# EAGLE design Breakout (EAGLE 6.5.0)
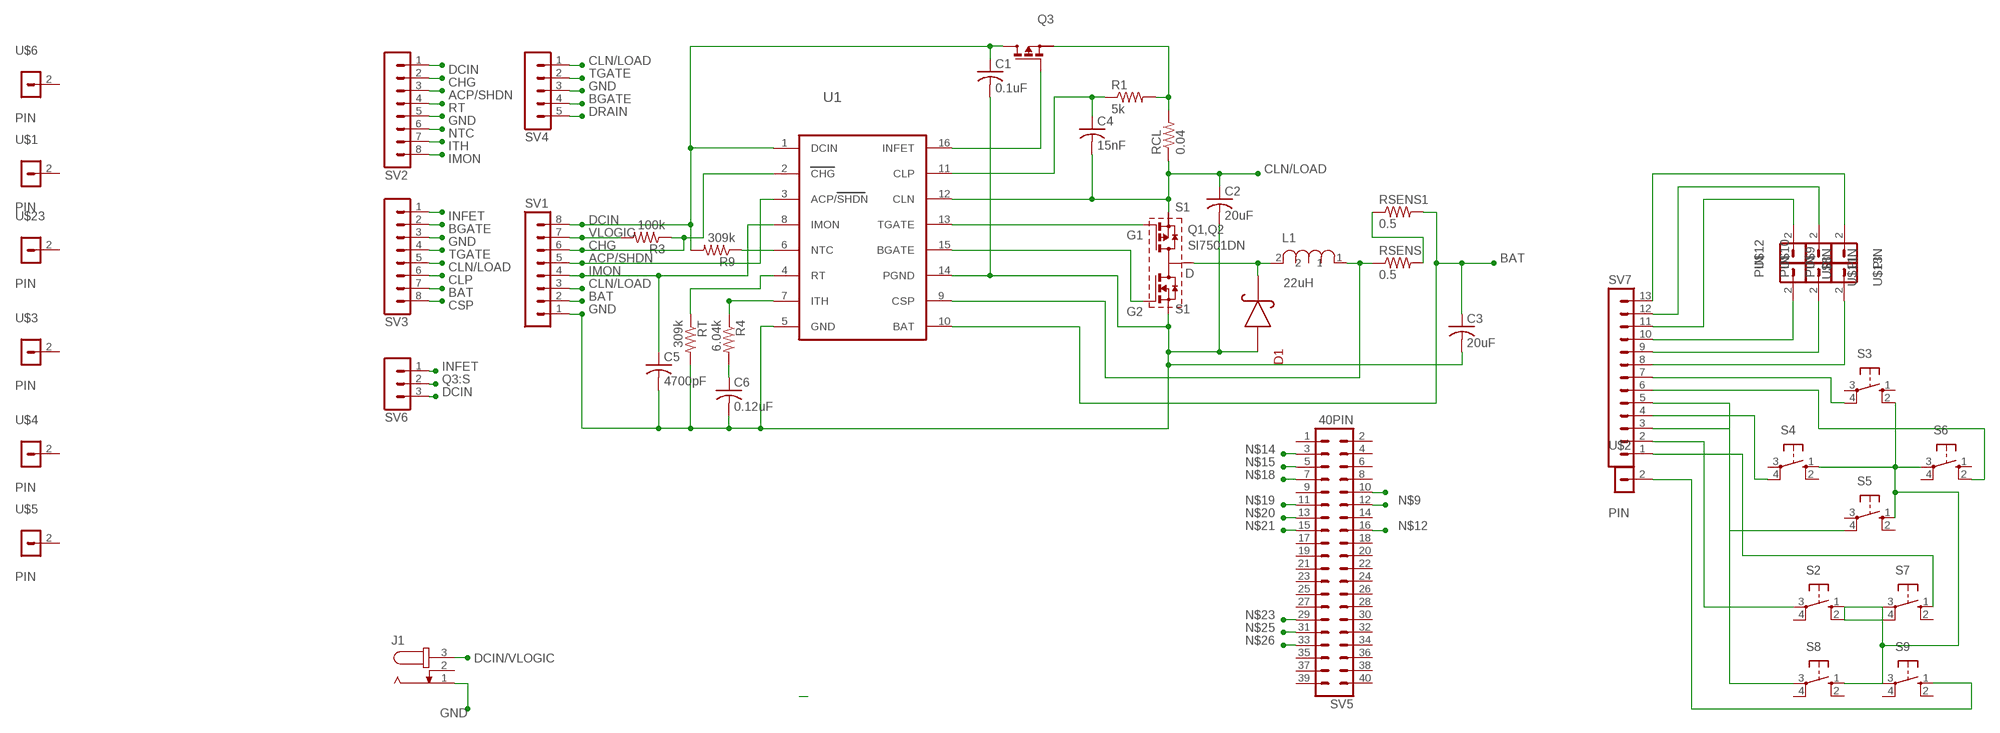
[diagram p0: schematic, sheet 1]

## Parts
C1  0.1uF  C-USC1210  [C1210]
C2  20uF  C-USC1210  [C1210]
C3  20uF  C-USC1210  [C1210]
C4  15nF  C-USC1210  [C1210]
C5  4700pF  C-USC1210  [C1210]
C6  0.12uF  C-USC1210  [C1210]
D1  DIODE  [DIODE]
J1  JACK-PLUG0  [SPC4077]
L1  22uH  SDR1005INDUCTOR  [POWERINDUCTOR]
Q1,Q2  SI7501DN  [POWERPAK]
Q3  MOSFET  [SOT-23]
R1  5k  R-US_R1206  [R1206]
R3  100k  R-US_R1206  [R1206]
R4  6.04k  R-US_R1206  [R1206]
R9  309k  R-US_R1206  [R1206]
RCL  0.04  R-US_R1206  [R1206]
RSENS  0.5  0612/1632  [0612/1632]
RSENS1  0.5  0612/1632  [0612/1632]
RT  309k  R-US_R1206  [R1206]
S2  10-XX  [B3F-10XX]
S3  10-XX  [B3F-10XX]
S4  10-XX  [B3F-10XX]
S5  10-XX  [B3F-10XX]
S6  10-XX  [B3F-10XX]
S7  10-XX  [B3F-10XX]
S8  10-XX  [B3F-10XX]
S9  10-XX  [B3F-10XX]
SV1  MA08-1  [MA08-1]
SV2  MA08-1  [MA08-1]
SV3  MA08-1  [MA08-1]
SV4  MA05-1  [MA05-1]
SV5  40PIN  [40PINHEADDER]
SV6  MA03-1  [MA03-1]
SV7  MA13-1  [MA13-1]
U1  LTC6004  [SSOP-16]
U$1  PIN  [PIN]
U$2  PIN  [PIN]
U$3  PIN  [PIN]
U$4  PIN  [PIN]
U$5  PIN  [PIN]
U$6  PIN  [PIN]
U$8  PIN  [PIN]
U$9  PIN  [PIN]
U$10  PIN  [PIN]
U$11  PIN  [PIN]
U$12  PIN  [PIN]
U$13  PIN  [PIN]
U$23  PIN  [PIN]

## Nets
ACP/SHDN: SV1.5 SV2.3 U1.3(ACP/SHDN)
BAT: C3.1 RSENS1.2 SV1.2 SV3.7 U1.10(BAT)
BGATE: Q1,Q2.G2 SV3.2 SV4.4 U1.15(BGATE)
CHG: R3.1 SV1.6 SV2.2 U1.2(CHG)
CLN/LOAD: C2.1 C4.2 Q1,Q2.S1 RCL.1 SV1.3 SV3.5 SV4.1 U1.12(CLN)
CLP: C4.1 R1.1 SV3.6 U1.11(CLP)
CSP: L1.1 RSENS.1 SV3.8 U1.9(CSP)
DCIN: C1.1 Q3.DRAIN(D) R9.2 SV1.8 SV2.1 SV6.3 U1.1(DCIN)
DCIN/VLOGIC: J1.3
DRAIN: D1.P$1 L1.2 Q1,Q2.D SV4.5
GND: C1.2 C2.2 C3.2 C5.2 C6.2 D1.P$2 J1.1 Q1,Q2.S2 RT.2 S2.1(S) S2.2(S1) S3.2(S1) S4.1(S) S5.1(S) S6.3(P) S7.3(P) S7.4(P1) S8.1(S) S9.3(P) SV1.1 SV2.5 SV3.3 SV4.3 U1.5(GND) U1.14(PGND)
IMON: C5.1 SV1.4 SV2.8 U1.8(IMON)
INFET: Q3.GATE(G) SV3.1 SV6.1 U1.16(INFET)
ITH: R4.1 SV2.7 U1.7(ITH)
N$1: RSENS1.1 RSENS.2
N$6: SV7.13 U$9.2
N$9: SV5.12
N$10: SV7.12 U$10.2
N$11: C6.1 R4.2
N$12: SV5.16
N$13: SV7.11 U$12.2
N$14: SV5.3
N$15: SV5.5
N$16: SV7.10 U$8.2
N$17: SV7.9 U$11.2
N$18: SV5.7
N$19: SV5.11
N$20: SV5.13
N$21: SV5.15
N$22: SV7.8 U$13.2
N$23: SV5.29
N$24: SV5.10
N$25: SV5.31
N$26: SV5.33
N$27: S3.4(P1) SV7.7
N$28: S6.2(S1) SV7.6
N$29: S4.4(P1) SV7.4
N$30: S5.4(P1) SV7.5
N$31: S8.3(P) SV7.3
N$32: S2.3(P) SV7.2
N$33: S7.1(S) SV7.1
N$34: S9.1(S) U$2.2
NTC: R9.1 SV2.6 U1.6(NTC)
Q3:S: Q3.SOURCE(S) R1.2 RCL.2 SV6.2
RT: RT.1 SV2.4 U1.4(RT)
TGATE: Q1,Q2.G1 SV3.4 SV4.2 U1.13(TGATE)
VLOGIC: R3.2 SV1.7
Unconnected: J1.2 S2.4(P1) S3.1(S) S3.3(P) S4.2(S1) S4.3(P) S5.2(S1) S5.3(P) S6.1(S) S6.4(P1) S7.2(S1) S8.2(S1) S8.4(P1) S9.2(S1) S9.4(P1) SV5.1 SV5.2 SV5.4 SV5.6 SV5.8 SV5.9 SV5.14 SV5.17 SV5.18 SV5.19 SV5.20 SV5.21 SV5.22 SV5.23 SV5.24 SV5.25 SV5.26 SV5.27 SV5.28 SV5.30 SV5.32 SV5.34 SV5.35 SV5.36 SV5.37 SV5.38 SV5.39 SV5.40 U$1.2 U$3.2 U$4.2 U$5.2 U$6.2 U$23.2

## Library data of the parts
C1-C6 = resistor:C-US: CAPACITOR, American symbol
D1 = Custom:DIODE
J1 = con-jack:JACK-PLUG: DC POWER JACK Power Jack, DC, Right Angle, Through Hole, Rated 5A at 16VDC, PC Terminals Distributor: Farnell (www.Farnell.de) Drawing: 84N1161.pdf / 84N1162.pdf Manufacturer: SPC Technology (www.spctechnology.com) Type: SPC4077 / SPC 4078; OC_FARNELL: unknown; OC_NEWARK: unknown
L1 = Custom:SDR1005INDUCTOR
Q1,Q2 = Custom:SI7501DN
Q3 = Custom:MOSFET
R1 R3 R4 R9 RCL RT = resistor:R-US_: RESISTOR, American symbol
RSENS RSENS1 = Custom:0612/1632
S2-S9 = switch-omron:10-XX: OMRON SWITCH; MPN: B3F-1000; OC_FARNELL: 176432; OC_NEWARK: 36M3542
SV1-SV3 = con-lstb:MA08-1: PIN HEADER; OC_FARNELL: unknown; OC_NEWARK: unknown
SV4 = con-lstb:MA05-1: PIN HEADER; OC_FARNELL: unknown; OC_NEWARK: unknown
SV5 = Custom:40PIN
SV6 = con-lstb:MA03-1: PIN HEADER; OC_FARNELL: unknown; OC_NEWARK: unknown
SV7 = con-lstb:MA13-1: PIN HEADER; OC_FARNELL: unknown; OC_NEWARK: unknown
U1 = Custom:LTC6004
U$1-U$6 U$8-U$13 U$23 = Custom:PIN

## Board
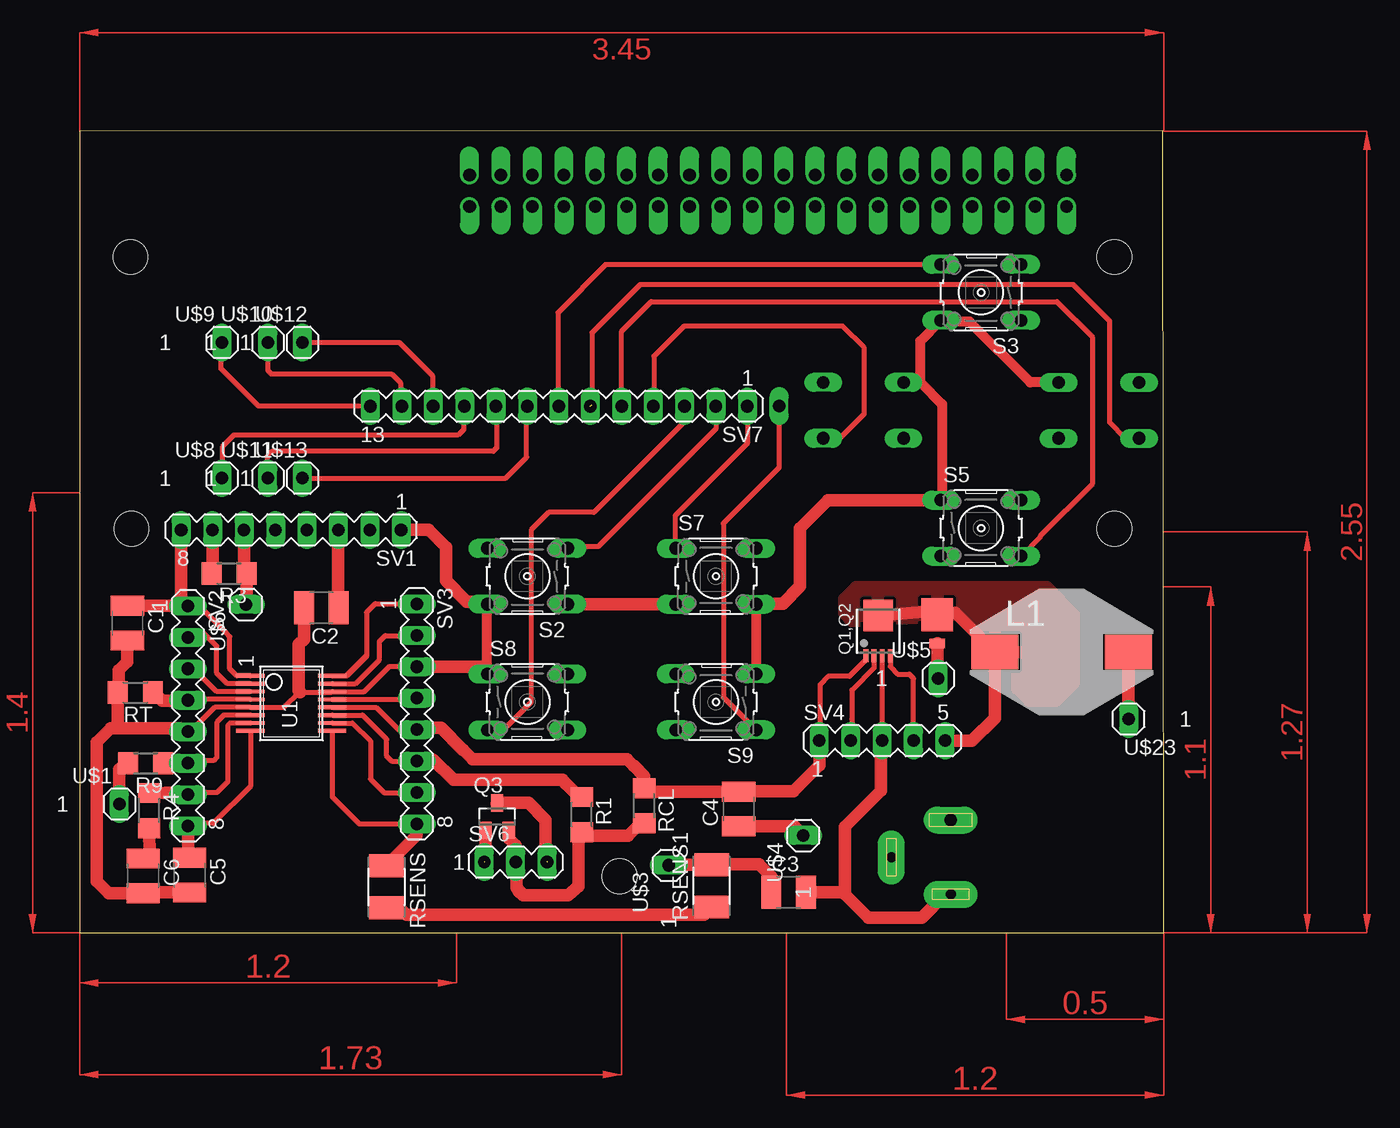
[diagram p1: board, top side]
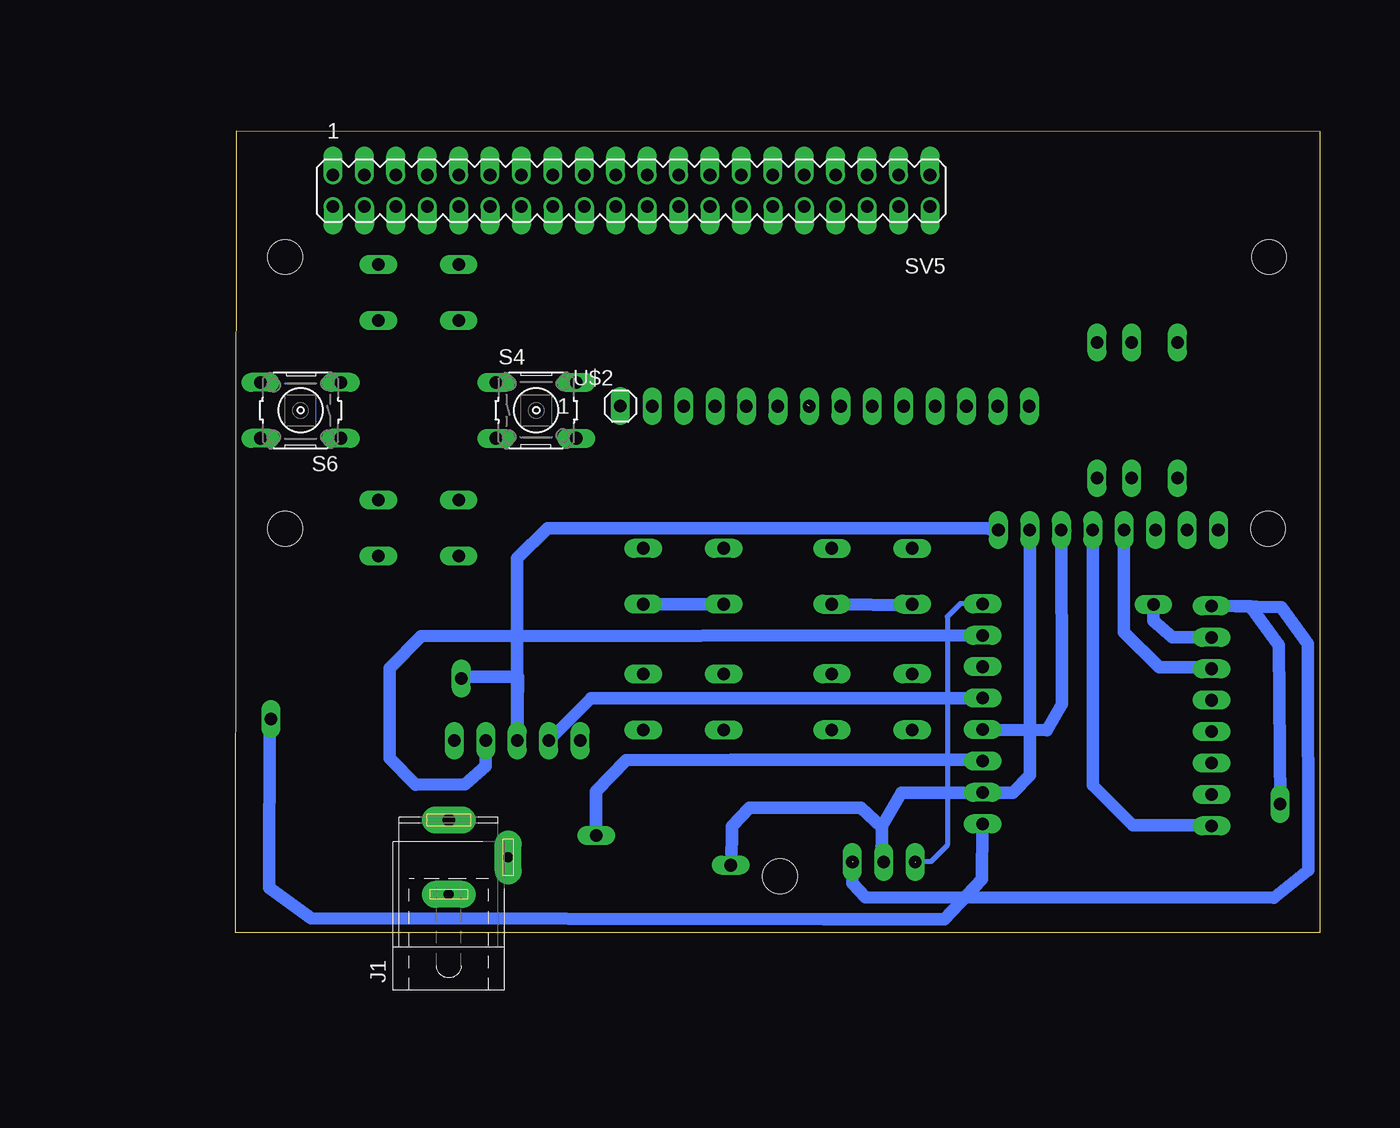
[diagram p2: board, bottom side, seen from below]

Size 87.63 x 64.8 mm. Coordinates in mm from the lower left corner, seen from the top.
Outline: 0,0 87.63,0 87.58,64.8 0,64.77 0,0
Copper layers (1*16): Top 0.035mm / dielectric 1.5mm / Bottom 0.035mm
Design rules "default": minimum track width 10mil, minimum drill 24mil, track to track 8mil, track to pad 8mil, pad to pad 8mil, via to via 8mil, smd to smd 8mil, copper to edge 40mil, drill to drill 8mil, minimum pad ring 10mil, minimum via ring 8mil, stop-mask expansion 4mil, vias tented up to drill 0mil, thermal gap 10mil
Holes 2.79 mm at 4.18,32.64 83.64,32.64 43.65,4.56 4.1,54.61 83.64,54.61

### Footprints (pad centres in the part's own frame; a part is rotated, then mirrored left to right if it is on the bottom)
C1210 = smd 1.6 x 2.7: 1 -1.4,0; 2 1.4,0
DIODE = smd 2.667 x 2.54: P$1 -1.638,0 | smd 0.762 x 1.27: P$2 0.699,0
SPC4077 = drill 0.8 pad 2.184 long: 1 -3,0; 2 0,-4.8 | drill 1 pad 2.184 long: 3 3,0
POWERINDUCTOR = smd 3.81 x 2.794: 1 5.397,0; 2 -5.397,0
POWERPAK = smd 2.4 x 2.54: D 0,1.27 | smd 0.4 x 1.016: G1 -0.325,-1.976; G2 0.975,-1.976; S1 -0.975,-1.976; S2 0.325,-1.976
SOT-23 = smd 1 x 1.4: DRAIN 0,1.1; GATE -0.95,-1.1; SOURCE 0.95,-1.1
R1206 = smd 1.6 x 1.803: 1 -1.422,0; 2 1.422,0
0612/1632 = smd 1.84 x 2.8: 1 -1.7,0; 2 1.7,0
B3F-10XX = drill 1.016 long: 1 -3.251,2.261; 2 3.251,2.261; 3 -3.251,-2.261; 4 3.251,-2.261
MA08-1 = drill 1.016 long: 1 -8.89,0; 2 -6.35,0; 3 -3.81,0; 4 -1.27,0; 5 1.27,0; 6 3.81,0; 7 6.35,0; 8 8.89,0
MA05-1 = drill 1.016 long: 1 -5.08,0; 2 -2.54,0; 3 0,0; 4 2.54,0; 5 5.08,0
40PINHEADDER = drill 1.016 offset: 1 -21.59,-1.27; 2 21.59,1.27; 3 -24.13,-1.27; 4 24.13,1.27; 5 -19.05,-1.27; 6 19.05,1.27; 7 -16.51,-1.27; 8 16.51,1.27; 9 -13.97,-1.27; 10 13.97,1.27; 11 -11.43,-1.27; 12 11.43,1.27; 13 -8.89,-1.27; 14 8.89,1.27; 15 -6.35,-1.27; 16 6.35,1.27; 17 -3.81,-1.27; 18 3.81,1.27; 19 -1.27,-1.27; 20 1.27,1.27; 21 1.27,-1.27; 22 -1.27,1.27; 23 3.81,-1.27; 24 -3.81,1.27; 25 6.35,-1.27; 26 -6.35,1.27; 27 8.89,-1.27; 28 -8.89,1.27; 29 11.43,-1.27; 30 -11.43,1.27; 31 13.97,-1.27; 32 -13.97,1.27; 33 16.51,-1.27; 34 -16.51,1.27; 35 19.05,-1.27; 36 -19.05,1.27; 37 21.59,-1.27; 38 -21.59,1.27; 39 24.13,-1.27; 40 -24.13,1.27
MA03-1 = drill 1.016 long: 1 -2.54,0; 2 0,0; 3 2.54,0
MA13-1 = drill 1.016 long: 1 -15.24,0; 2 -12.7,0; 3 -10.16,0; 4 -7.62,0; 5 -5.08,0; 6 -2.54,0; 7 0,0; 8 2.54,0; 9 5.08,0; 10 7.62,0; 11 10.16,0; 12 12.7,0; 13 15.24,0
SSOP-16 = smd 2.286 x 0.305: 1 -3.302,2.349; 2 -3.302,1.714; 3 -3.302,1.079; 4 -3.302,0.444; 5 -3.302,-0.191; 6 -3.302,-0.826; 7 -3.302,-1.461; 8 -3.302,-2.096; 9 3.302,-2.096; 10 3.302,-1.461; 11 3.302,-0.826; 12 3.302,-0.191; 13 3.302,0.444; 14 3.302,1.079; 15 3.302,1.714; 16 3.302,2.349
PIN = drill 1.016 long: 2 0,0

### Placement (x,y rotation side)
C1  3.86,25.01 270 top
C2  19.54,26.26 180 top
C3  57.31,3.27 0 top
C4  53.28,10 90 top
C5  8.89,4.65 270 top
C6  5.14,4.59 270 top
D1  69.32,24.07 270 top
J1  70.42,6.09 90 bottom
L1  79.37,22.68 0 top
Q1,Q2  64.55,24.36 0 top
Q3  33.75,9.38 0 top
R1  40.58,9.54 270 top
R3  12.08,29.03 180 top
R4  5.62,9.86 270 top
R9  5.34,13.69 180 top
RCL  45.64,10.26 270 top
RSENS  24.79,3.71 270 top
RSENS1  51.09,3.78 90 top
RT  4.51,19.4 180 top
S2  36.2,28.81 180 top
S3  72.87,51.74 180 top
S4  63.35,42.22 0 bottom
S5  72.87,32.69 0 top
S6  82.4,42.22 180 bottom
S7  51.44,28.81 0 top
S8  36.2,18.65 0 top
S9  51.44,18.65 180 top
SV1  17.1,32.55 180 top
SV2  8.76,17.52 270 top
SV3  27.25,17.68 270 top
SV4  64.88,15.52 0 top
SV5  55.65,59.97 180 bottom
SV6  35.25,5.7 0 top
SV7  38.73,42.54 180 top
U1  17.11,18.41 0 top
U$1  3.21,10.4 0 top
U$2  56.55,42.56 0 bottom
U$3  47.62,5.45 90 top
U$4  58.5,7.86 90 top
U$5  69.42,20.56 0 top
U$6  13.46,26.53 90 top
U$8  11.51,36.73 0 top
U$9  11.51,47.7 0 top
U$10  15.21,47.7 0 top
U$11  15.21,36.73 0 top
U$12  18.01,47.7 0 top
U$13  18.01,36.73 0 top
U$23  84.8,17.27 180 top

### Tracks (layer width: path | path; a pad name or v marks a point on that pad's centre or on a via)
ACP/SHDN
  Top 0.406: U1.3 11.09,19.48 9.02,21.55 8.19,21.55 SV2.3
  Bottom 1.016: SV1.5 15.83,24.27 12.99,21.44 8.87,21.44 SV2.3
BAT  (via drill 0.6)
  Top 0.406: U1.10 22.06,16.95 23.5,15.5 23.5,12.42 24.59,11.32 27.24,11.32 SV3.7
  Top 1.016: C3.1 55.91,4.54 54.94,5.51 51.12,5.51 RSENS1.2 48.34,5.48 v47.55,5.47
  Bottom 1.016: SV1.2 23.45,12.71 24.83,11.32 27.24,11.32 SV3.7 27.33,11.25 28.86,11.31 33.84,11.29 35.41,8.59 35.42,5.61 35.41,8.53 37.1,10.12 46.1,10.11 47.53,8.6 v47.55,5.47
BGATE
  Top 0.406: U1.15 22.3,20.12 24.24,22.06 24.24,23.55 24.44,23.74 | 24.44,23.74 | 24.44,23.74 24.71,24.02 27.23,24.02 SV3.2 | SV4.4 67.42,20.55 67.07,20.9 66.13,20.9 65.53,21.5 Q1,Q2.G2
  Bottom 1.016: SV3.2 72.65,23.95 75.21,21.37 75.2,14.1 73.1,11.95 69.08,11.98 67.43,13.44 SV4.4
CHG  (via drill 0.6)
  Top 0.406: U1.2 11.94,20.12 11.09,20.96 11.09,23.15 10.04,24.21 8.2,24.21 SV2.2
  Top 1.016: SV1.6 13.29,29.25 R3.1 13.51,26.58 v13.45,26.52
  Bottom 1.016: v13.45,26.52 13.44,25.23 11.94,23.87 8.98,23.9 SV2.2
CLN/LOAD  (via drill 0.6)
  Top 0.406: C2.1 20.94,32.55 v20.89,32.61 | U1.12 23.95,18.21 25.72,16.44 27.22,16.44 SV3.5 | SV4.1 59.85,17.26 59.85,20.05 60.51,20.72 62.24,20.72 63.58,22.05 Q1,Q2.S1
  Top 1.016: SV1.3 20.91,26.29 C2.1 | SV4.1 59.8,13.53 57.69,11.42 53.3,11.42 C4.2 46.47,11.39 RCL.1 45.64,12.65 44.82,13.47 44.78,13.47 44.23,14.02 31.78,14.02 31,14.8 30.96,14.8 29.22,16.54 27.38,16.54 SV3.5
  Bottom 0.406: 27.27,16.44 SV3.5
  Bottom 1.016: v20.89,32.61 20.89,32.51 20.57,32.5 20.9,33.05 20.85,18.48 22.08,16.37 27.13,16.4 27.27,16.62 27.38,16.54 SV3.5
CLP  (via drill 0.6)
  Top 0.406: U1.11 22.87,17.58 24.83,15.62 24.83,14.25 25.22,13.87 27.24,13.87 SV3.6
  Top 1.016: 39.27,12.03 40.34,10.97 R1.1 40.41,10.97 39.04,12.34 30.22,12.34 28.58,13.98 27.35,13.98 SV3.6 | C4.1 57.78,8.6 v58.51,7.87
  Bottom 1.016: SV3.6 27.35,13.98 47.56,13.98 47.52,13.98 56.07,13.96 58.51,11.45 v58.51,7.87
CSP  (via drill 0.6)
  Top 0.406: U1.9 20.41,10.97 22.59,8.79 24.89,8.79 SV3.8
  Top 1.016: SV3.8 27.25,7.86 RSENS.1 | 84.83,17.2 v84.91,17.25 84.77,18.98 L1.1
  Bottom 1.016: v84.91,17.25 84.93,3.63 81.55,1.16 40.1,1.09 30.35,1.09 27.31,4.33 27.27,8.6 27.03,8.47 SV3.8
DCIN  (via drill 0.6)  (1 unrouted)
  Top 0.406: U1.1 12.71,20.75 12.15,21.32 12.15,23.93 11.87,24.21 9.45,26.63 8.19,26.63 SV2.1
  Top 1.016: C1.1 SV2.1 8.21,26.96 SV1.8 | R9.2 3.69,13.69 3.2,13.2 v3.2,10.41 | 33.7,10.43 Q3.DRAIN 36.29,10.48 37.67,9.1 37.67,5.85 v37.77,5.76
  Bottom 1.016: v3.2,10.41 3.31,23.23 5.64,26.37 SV2.1 3.13,26.32 0.97,23.35 0.92,5.04 3.74,2.82 36.74,2.87 37.77,4 v37.77,5.76
DRAIN
  Top 1.016: SV4.5 72.15,15.52 73.98,17.34 L1.2 70.79,25.86 D1.P$1 69.18,26.01 Q1,Q2.D
  pour Top: 62.99,25.22 62.4,25.22 61.82,25.81 61.82,26.98 62.77,27.93 78.17,27.93 80.43,25.67 80.43,20.25 78.94,18.76 76.73,18.76 75.78,19.71 75.78,21.43 71.53,25.67
GND  (via drill 0.6)
  Top 0.406: SV2.5 8.14,16.51 9.22,16.51 10.92,18.21 U1.5 16.5,18.21 17.73,19.44 17.82,19.44 20.37,19.44 U1.14 23.01,19.48 25.05,21.52 27.22,21.52 SV3.3 | Q1,Q2.S2 64.88,17.21 SV4.3
  Top 0.813: S9.3 S7.4 | S8.1 S2.2 v32.98,26.47 | S3.2 70.46,49.48 | S4.1 67.95,44.48 | 67.95,44.48 69.72,42.71 69.72,35.05 S5.1 | 67.95,44.48 67.95,47.81 S3.2 | S6.3 76.85,44.48 71.94,49.39 69.71,49.39 S3.2
  Top 1.016: C5.2 4.81,3.25 | 4.81,3.25 4.3,3.25 C6.2 | 8.14,16.51 3.29,16.51 | 4.81,3.25 4.75,3.18 2.35,3.18 1.37,4.17 1.37,15.38 2.51,16.51 3.29,16.51 | 3.29,16.51 3.09,16.72 RT.2 3.15,19.47 3.15,21.2 3.86,21.91 C1.2 | C2.2 18.14,23.72 17.71,23.29 17.71,19.55 17.82,19.44 | S2.1 S7.3 | D1.P$2 69.32,20.74 v69.28,20.67 | SV1.1 28.22,32.55 29.61,31.16 29.61,28.44 31.29,26.76 32.73,26.76 S2.2 | J1.1 69.97,3.09 68.09,1.22 63.77,1.22 61.88,3.11 | 61.88,3.11 61.88,8.58 64.78,11.48 64.78,15.42 SV4.3 | SV3.3 32.36,21.49 S8.1 | C3.2 61.72,3.27 61.88,3.11 | S5.1 60.5,34.95 58.25,32.7 58.25,27.98 56.85,26.58 54.72,26.58 S7.4
  Bottom 0.406: S2.2 32.86,26.56 | S8.1 33.01,21.09
  Bottom 1.016: v32.98,26.47 S2.1 | S7.3 S7.4 | v69.28,20.67 69.04,20.7 64.8,20.7 SV4.3 64.88,30.26 62.44,32.7 26.75,32.7 26.6,32.55 SV1.1
IMON
  Top 0.406: U1.8 13.81,11.85 10.81,8.84 9.2,8.84 SV2.8
  Top 1.016: SV2.8 8.76,6.07 C5.1
  Bottom 1.016: SV1.4 18.37,11.9 15.13,8.66 8.8,8.66 SV2.8
INFET  (via drill 0.6)  (1 unrouted)
  Top 0.406: U1.16 21.61,20.75 | SV3.1 24.88,26.55 23.85,26.55 23.19,25.89 23.19,22.34 21.61,20.75 | 21.61,20.75 21.61,20.83 23.16,22.38 23.16,22.44 23.22,22.5 23.22,25.93 23.89,26.59 27.16,26.59 27.25,26.5 27.38,26.5 v27.46,26.59
  Top 1.016: Q3.GATE 32.8,5.68 SV6.1
  Bottom 0.406: v27.46,26.59 29.06,26.59 30.11,25.54 30.11,7.07 31.44,5.75 v32.72,5.75 v32.73,5.74
ITH
  Top 0.406: U1.7 12.15,16.95 11.97,16.76 11.97,12.21 11.08,11.31 9.2,11.31 SV2.7
  Top 1.016: R4.1 8.03,11.33 SV2.7
N$1
  Top 1.016: RSENS.2 25.88,2.01 26.43,1.46 50.47,1.46 RSENS1.1
N$2  (via drill 0.6 pad 0.81)
  other vias: 11.51,36.73
N$3  (via drill 0.6 pad 0.81)
  other vias: 15.21,36.73
N$4  (via drill 0.6 pad 0.81)
  other vias: 18.01,36.73
N$5  (via drill 0.6 pad 0.81)
  other vias: 11.51,47.7
N$6
  Top 0.406: SV7.13 14.46,42.54 11.43,45.57 11.43,47.62 U$9.2
N$7  (via drill 0.6 pad 0.81)
  other vias: 15.21,47.7
N$8  (via drill 0.6 pad 0.81)
  other vias: 18.01,47.7
N$10
  Top 0.406: U$10.2 15.21,45.44 15.48,45.17 25.2,45.17 25.93,44.44 25.93,42.64 SV7.12
N$11
  Top 1.016: R4.2 5.67,6.09 C6.1
N$13
  Top 0.406: U$12.2 25.83,47.7 28.53,45 28.53,42.59 SV7.11
N$16
  Top 0.406: SV7.10 31.04,42.62 31.04,40.65 30.59,40.2 12.46,40.2 11.52,39.27 11.52,36.74 U$8.2 11.57,36.79
N$17
  Top 0.406: U$11.2 15.21,38.57 15.54,38.91 33.44,38.91 33.71,39.18 33.71,42.48 SV7.9
N$22
  Top 0.406: U$13.2 34.44,36.73 36.15,38.44 36.15,42.49 SV7.8
N$27
  Top 0.406: SV7.7 38.66,42.62 38.66,50.11 42.55,54 S3.4
N$28  (1 unrouted)
  Top 0.406: 41.41,42.68 41.41,48.49 45.3,52.38 80.31,52.38 83.27,49.43 83.27,41.24 84.55,39.96 S6.2
N$29
  Top 0.406: S4.4 61.46,39.96 63.43,41.93 63.43,47.27 61.68,49.02 48.86,49.02 46.43,46.59 46.43,42.62 SV7.4
N$30
  Top 0.406: SV7.5 43.81,48.62 46.2,51 79.02,51 81.85,48.17 81.85,36.24 77.64,32.03 77.64,31.95 S5.4
N$31
  Top 0.406: SV7.3 48.89,41.29 41.57,33.97 37.93,33.97 36.51,32.55 36.51,18.64 34.28,16.41 32.97,16.41 S8.3
N$32
  Top 0.406: SV7.2 51.43,40.72 41.91,31.2 39.58,31.2 S2.3
N$33
  Top 0.406: SV7.1 53.97,39.54 48.13,33.7 48.13,31.12 S7.1
N$34
  Top 0.406: U$2.2 56.55,37.58 52.05,33.08 52.05,19.02 S9.1
NTC
  Top 0.406: U1.6 11.65,17.58 11.08,17.01 11.08,14.16 10.83,13.92 9.2,13.92 SV2.6 8.74,13.69 R9.1
Q3:S
  Top 1.016: RCL.2 45.22,8.72 44.35,7.85 41.42,7.85 R1.2 40.34,7.31 40.34,3.75 39.49,3.02 35.86,3.02 35.48,3.37 35.64,3.27 35.3,3.61 35.3,5.69 35.29,5.7 SV6.2 | 34.94,5.62 SV6.2 | Q3.SOURCE 34.7,7.61 35.23,7.07 35.23,5.72 SV6.2
RT
  Top 0.406: U1.4 8.35,18.85 SV2.4
  Top 1.016: RT.1 5.99,19.4 6.66,18.73 8.71,18.73 SV2.4
TGATE
  Top 0.406: U1.13 27.14,18.85 SV3.4 | Q1,Q2.G1 64.23,21.41 62.42,19.6 62.42,17.29 SV4.2
  Bottom 1.016: SV3.4 58.9,18.95 SV4.2
VLOGIC
  Top 1.016: SV1.7 10.75,29.11 R3.2
(copper drawn outside any net)
  shapes: Top area x9